# Altium schematic sheet Sheet3.SchDoc
size A
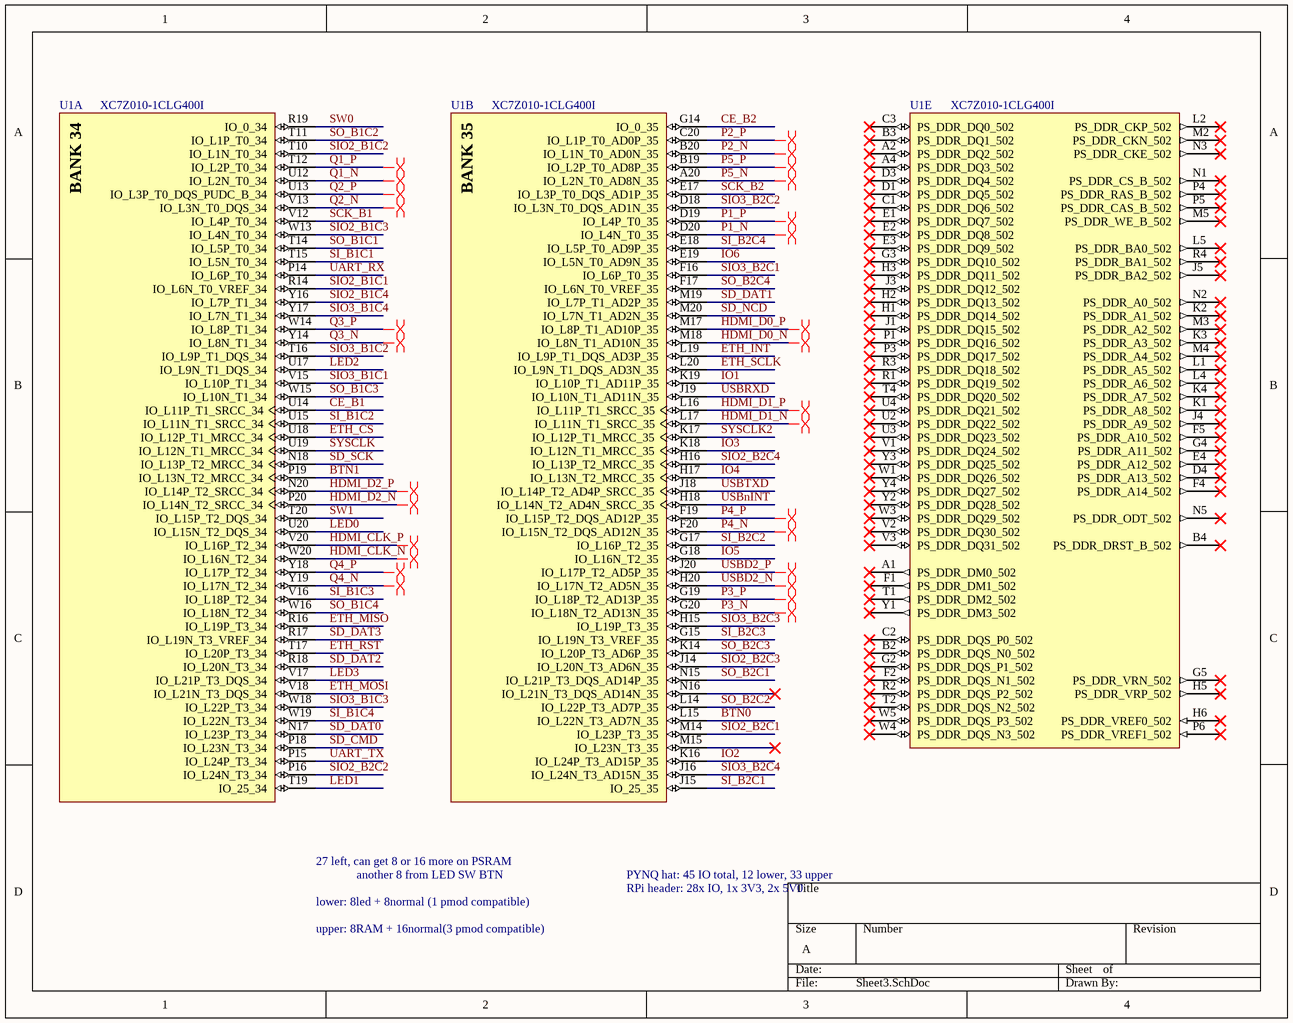
[diagram p0: Sheet3.SchDoc]

## Parts
U1  XC7Z010-1CLG400I  [CLG400]  (parts A,B,E of 9)

## Nets
BTN0: U1.L15(IO_L22N_T3_AD7N_35)
BTN1: U1.P19(IO_L13N_T2_MRCC_34)
CE_B1: U1.U14(IO_L11P_T1_SRCC_34)
CE_B2: U1.G14(IO_0_35)
ETH_CS: U1.U18(IO_L12P_T1_MRCC_34)
ETH_INT: U1.L19(IO_L9P_T1_DQS_AD3P_35)
ETH_MISO: U1.R16(IO_L19P_T3_34)
ETH_MOSI: U1.V18(IO_L21N_T3_DQS_34)
ETH_RST: U1.T17(IO_L20P_T3_34)
ETH_SCLK: U1.L20(IO_L9N_T1_DQS_AD3N_35)
HDMI_CLK_N: U1.W20(IO_L16N_T2_34)
HDMI_CLK_P: U1.V20(IO_L16P_T2_34)
HDMI_D0_N: U1.M18(IO_L8N_T1_AD10N_35)
HDMI_D0_P: U1.M17(IO_L8P_T1_AD10P_35)
HDMI_D1_N: U1.L17(IO_L11N_T1_SRCC_35)
HDMI_D1_P: U1.L16(IO_L11P_T1_SRCC_35)
HDMI_D2_N: U1.P20(IO_L14N_T2_SRCC_34)
HDMI_D2_P: U1.N20(IO_L14P_T2_SRCC_34)
IO1: U1.K19(IO_L10P_T1_AD11P_35)
IO2: U1.K16(IO_L24P_T3_AD15P_35)
IO3: U1.K18(IO_L12N_T1_MRCC_35)
IO4: U1.H17(IO_L13N_T2_MRCC_35)
IO5: U1.G18(IO_L16N_T2_35)
IO6: U1.E19(IO_L5N_T0_AD9N_35)
LED0: U1.U20(IO_L15N_T2_DQS_34)
LED1: U1.T19(IO_25_34)
LED2: U1.U17(IO_L9N_T1_DQS_34)
LED3: U1.V17(IO_L21P_T3_DQS_34)
P1_N: U1.D20(IO_L4N_T0_35)
P1_P: U1.D19(IO_L4P_T0_35)
P2_N: U1.B20(IO_L1N_T0_AD0N_35)
P2_P: U1.C20(IO_L1P_T0_AD0P_35)
P3_N: U1.G20(IO_L18N_T2_AD13N_35)
P3_P: U1.G19(IO_L18P_T2_AD13P_35)
P4_N: U1.F20(IO_L15N_T2_DQS_AD12N_35)
P4_P: U1.F19(IO_L15P_T2_DQS_AD12P_35)
P5_N: U1.A20(IO_L2N_T0_AD8N_35)
P5_P: U1.B19(IO_L2P_T0_AD8P_35)
Q1_N: U1.U12(IO_L2N_T0_34)
Q1_P: U1.T12(IO_L2P_T0_34)
Q2_N: U1.V13(IO_L3N_T0_DQS_34)
Q2_P: U1.U13(IO_L3P_T0_DQS_PUDC_B_34)
Q3_N: U1.Y14(IO_L8N_T1_34)
Q3_P: U1.W14(IO_L8P_T1_34)
Q4_N: U1.Y19(IO_L17N_T2_34)
Q4_P: U1.Y18(IO_L17P_T2_34)
SCK_B1: U1.V12(IO_L4P_T0_34)
SCK_B2: U1.E17(IO_L3P_T0_DQS_AD1P_35)
SD_CMD: U1.P18(IO_L23N_T3_34)
SD_DAT0: U1.N17(IO_L23P_T3_34)
SD_DAT1: U1.M19(IO_L7P_T1_AD2P_35)
SD_DAT2: U1.R18(IO_L20N_T3_34)
SD_DAT3: U1.R17(IO_L19N_T3_VREF_34)
SD_NCD: U1.M20(IO_L7N_T1_AD2N_35)
SD_SCK: U1.N18(IO_L13P_T2_MRCC_34)
SI_B1C1: U1.T15(IO_L5N_T0_34)
SI_B1C2: U1.U15(IO_L11N_T1_SRCC_34)
SI_B1C3: U1.V16(IO_L18P_T2_34)
SI_B1C4: U1.W19(IO_L22N_T3_34)
SI_B2C1: U1.J15(IO_25_35)
SI_B2C2: U1.G17(IO_L16P_T2_35)
SI_B2C3: U1.G15(IO_L19N_T3_VREF_35)
SI_B2C4: U1.E18(IO_L5P_T0_AD9P_35)
SIO2_B1C1: U1.R14(IO_L6N_T0_VREF_34)
SIO2_B1C2: U1.T10(IO_L1N_T0_34)
SIO2_B1C3: U1.W13(IO_L4N_T0_34)
SIO2_B1C4: U1.Y16(IO_L7P_T1_34)
SIO2_B2C1: U1.M14(IO_L23P_T3_35)
SIO2_B2C2: U1.P16(IO_L24N_T3_34)
SIO2_B2C3: U1.J14(IO_L20N_T3_AD6N_35)
SIO2_B2C4: U1.H16(IO_L13P_T2_MRCC_35)
SIO3_B1C1: U1.V15(IO_L10P_T1_34)
SIO3_B1C2: U1.T16(IO_L9P_T1_DQS_34)
SIO3_B1C3: U1.W18(IO_L22P_T3_34)
SIO3_B1C4: U1.Y17(IO_L7N_T1_34)
SIO3_B2C1: U1.F16(IO_L6P_T0_35)
SIO3_B2C2: U1.D18(IO_L3N_T0_DQS_AD1N_35)
SIO3_B2C3: U1.H15(IO_L19P_T3_35)
SIO3_B2C4: U1.J16(IO_L24N_T3_AD15N_35)
SO_B1C1: U1.T14(IO_L5P_T0_34)
SO_B1C2: U1.T11(IO_L1P_T0_34)
SO_B1C3: U1.W15(IO_L10N_T1_34)
SO_B1C4: U1.W16(IO_L18N_T2_34)
SO_B2C1: U1.N15(IO_L21P_T3_DQS_AD14P_35)
SO_B2C2: U1.L14(IO_L22P_T3_AD7P_35)
SO_B2C3: U1.K14(IO_L20P_T3_AD6P_35)
SO_B2C4: U1.F17(IO_L6N_T0_VREF_35)
SW0: U1.R19(IO_0_34)
SW1: U1.T20(IO_L15P_T2_DQS_34)
SYSCLK: U1.U19(IO_L12N_T1_MRCC_34)
SYSCLK2: U1.K17(IO_L12P_T1_MRCC_35)
UART_RX: U1.P14(IO_L6P_T0_34)
UART_TX: U1.P15(IO_L24P_T3_34)
USBD2_N: U1.H20(IO_L17N_T2_AD5N_35)
USBD2_P: U1.J20(IO_L17P_T2_AD5P_35)
USBnINT: U1.H18(IO_L14N_T2_AD4N_SRCC_35)
USBRXD: U1.J19(IO_L10N_T1_AD11N_35)
USBTXD: U1.J18(IO_L14P_T2_AD4P_SRCC_35)

Not connected (* = marked no-connect by the designer): U1 A1(PS_DDR_DM0_502)* A2(PS_DDR_DQ2_502)* A4(PS_DDR_DQ3_502)* B2(PS_DDR_DQS_N0_502)* B3(PS_DDR_DQ1_502)* B4(PS_DDR_DRST_B_502)* C1(PS_DDR_DQ6_502)* C2(PS_DDR_DQS_P0_502)* C3(PS_DDR_DQ0_502)* D1(PS_DDR_DQ5_502)* D3(PS_DDR_DQ4_502)* D4(PS_DDR_A13_502)* E1(PS_DDR_DQ7_502)* E2(PS_DDR_DQ8_502)* E3(PS_DDR_DQ9_502)* E4(PS_DDR_A12_502)* F1(PS_DDR_DM1_502)* F2(PS_DDR_DQS_N1_502)* F4(PS_DDR_A14_502)* F5(PS_DDR_A10_502)* G2(PS_DDR_DQS_P1_502)* G3(PS_DDR_DQ10_502)* G4(PS_DDR_A11_502)* G5(PS_DDR_VRN_502)* H1(PS_DDR_DQ14_502)* H2(PS_DDR_DQ13_502)* H3(PS_DDR_DQ11_502)* H5(PS_DDR_VRP_502)* H6(PS_DDR_VREF0_502)* J1(PS_DDR_DQ15_502)* J3(PS_DDR_DQ12_502)* J4(PS_DDR_A9_502)* J5(PS_DDR_BA2_502)* K1(PS_DDR_A8_502)* K2(PS_DDR_A1_502)* K3(PS_DDR_A3_502)* K4(PS_DDR_A7_502)* L1(PS_DDR_A5_502)* L2(PS_DDR_CKP_502)* L4(PS_DDR_A6_502)* L5(PS_DDR_BA0_502)* M2(PS_DDR_CKN_502)* M3(PS_DDR_A2_502)* M4(PS_DDR_A4_502)* M5(PS_DDR_WE_B_502)* M15(IO_L23N_T3_35)* N1(PS_DDR_CS_B_502)* N2(PS_DDR_A0_502)* N3(PS_DDR_CKE_502)* N5(PS_DDR_ODT_502)* N16(IO_L21N_T3_DQS_AD14N_35)* P1(PS_DDR_DQ16_502)* P3(PS_DDR_DQ17_502)* P4(PS_DDR_RAS_B_502)* P5(PS_DDR_CAS_B_502)* P6(PS_DDR_VREF1_502)* R1(PS_DDR_DQ19_502)* R2(PS_DDR_DQS_P2_502)* R3(PS_DDR_DQ18_502)* R4(PS_DDR_BA1_502)* T1(PS_DDR_DM2_502)* T2(PS_DDR_DQS_N2_502)* T4(PS_DDR_DQ20_502)* U2(PS_DDR_DQ22_502)* U3(PS_DDR_DQ23_502)* U4(PS_DDR_DQ21_502)* V1(PS_DDR_DQ24_502)* V2(PS_DDR_DQ30_502)* V3(PS_DDR_DQ31_502)* W1(PS_DDR_DQ26_502)* W3(PS_DDR_DQ29_502)* W4(PS_DDR_DQS_N3_502)* W5(PS_DDR_DQS_P3_502)* Y1(PS_DDR_DM3_502)* Y2(PS_DDR_DQ28_502)* Y3(PS_DDR_DQ25_502)* Y4(PS_DDR_DQ27_502)*

## Layout directives
differential pair: HDMI_CLK_N, HDMI_CLK_P, HDMI_D0_N, HDMI_D0_P, HDMI_D1_N, HDMI_D1_P, HDMI_D2_N, HDMI_D2_P, P1_N, P1_P, P2_N, P2_P, P3_N, P3_P, P4_N, P4_P, P5_N, P5_P, Q1_N, Q1_P, Q2_N, Q2_P, Q3_N, Q3_P, Q4_N, Q4_P, USBD2_N, USBD2_P

## Notes on the sheet
- 27 left, can get 8 or 16 more on PSRAM
- lower: 8led + 8normal (1 pmod compatible)
- another 8 from LED SW BTN
- PYNQ hat: 45 IO total, 12 lower, 33 upper
- RPi header: 28x IO, 1x 3V3, 2x 5V0
- upper: 8RAM + 16normal(3 pmod compatible)
- (in symbol XC7Z010-1CLG400I, part A) BANK 34
- (in symbol XC7Z010-1CLG400I, part B) BANK 35

## Library data of the parts
U1 = XC7Z010-1CLG400I: 667 MHz Zynq?7000 AP SoC, 130 PS I/O, 100 FPGA I/O, 400-Ball BGA, Speed Grade 1, Industrial Grade, Pb-Free; Manufacturer: Xilinx; Extensible Block RAM (# 36Kb Blocks): 240 KB (60); Flip Flops: 35200; LUTs: 17600; Speed Grade: -1; DatasheetVersion: v1.2; PackageVersion: Rev 1.1; PackageReference: CLG400; PackageDescription: Wire-Bond Chip-Scale BGA, Body 17 x 17 mm, 0.8 mm Pitch; Generic Part Number: XC7Z010; RoHS: Pb-Free; Mounting Technology: Surface Mount; Code_JEDEC: MO-275-MMAA-1; PartNumber: XC7Z010-1CLG400I; ComponentLink1Description: Datasheet; ComponentLink1URL: http://www.xilinx.com/support/documentation/data_sheets/ds190-Zynq-7000-Overview.pdf; ComponentLink2Description: Package Specification; ComponentLink2URL: http://www.xilinx.com/support/documentation/user_guides/ug865-Zynq-7000-Pkg-Pinout.pdf; ComponentLink3Description: DC and AC Switching Characteristics; ComponentLink3URL: http://www.xilinx.com/support/documentation/data_sheets/ds187-XC7Z010-XC7Z020-Data-Sheet.pdf; ComponentLink4Description: Package File; ComponentLink4URL: http://www.xilinx.com/support/packagefiles/z7packages/xc7z010clg400pkg.txt; ComponentLink5Description: Packaging and Pinout; ComponentLink5URL: http://www.xilinx.com/support/documentation/user_guides/ug865-Zynq-7000-Pkg-Pinout.pdf; ComponentLink6Description: PCB and Layout Guide; ComponentLink6URL: http://www.xilinx.com/support/documentation/user_guides/ug483_7Series_PCB.pdf